# EAGLE design Processor (EAGLE 6.1)
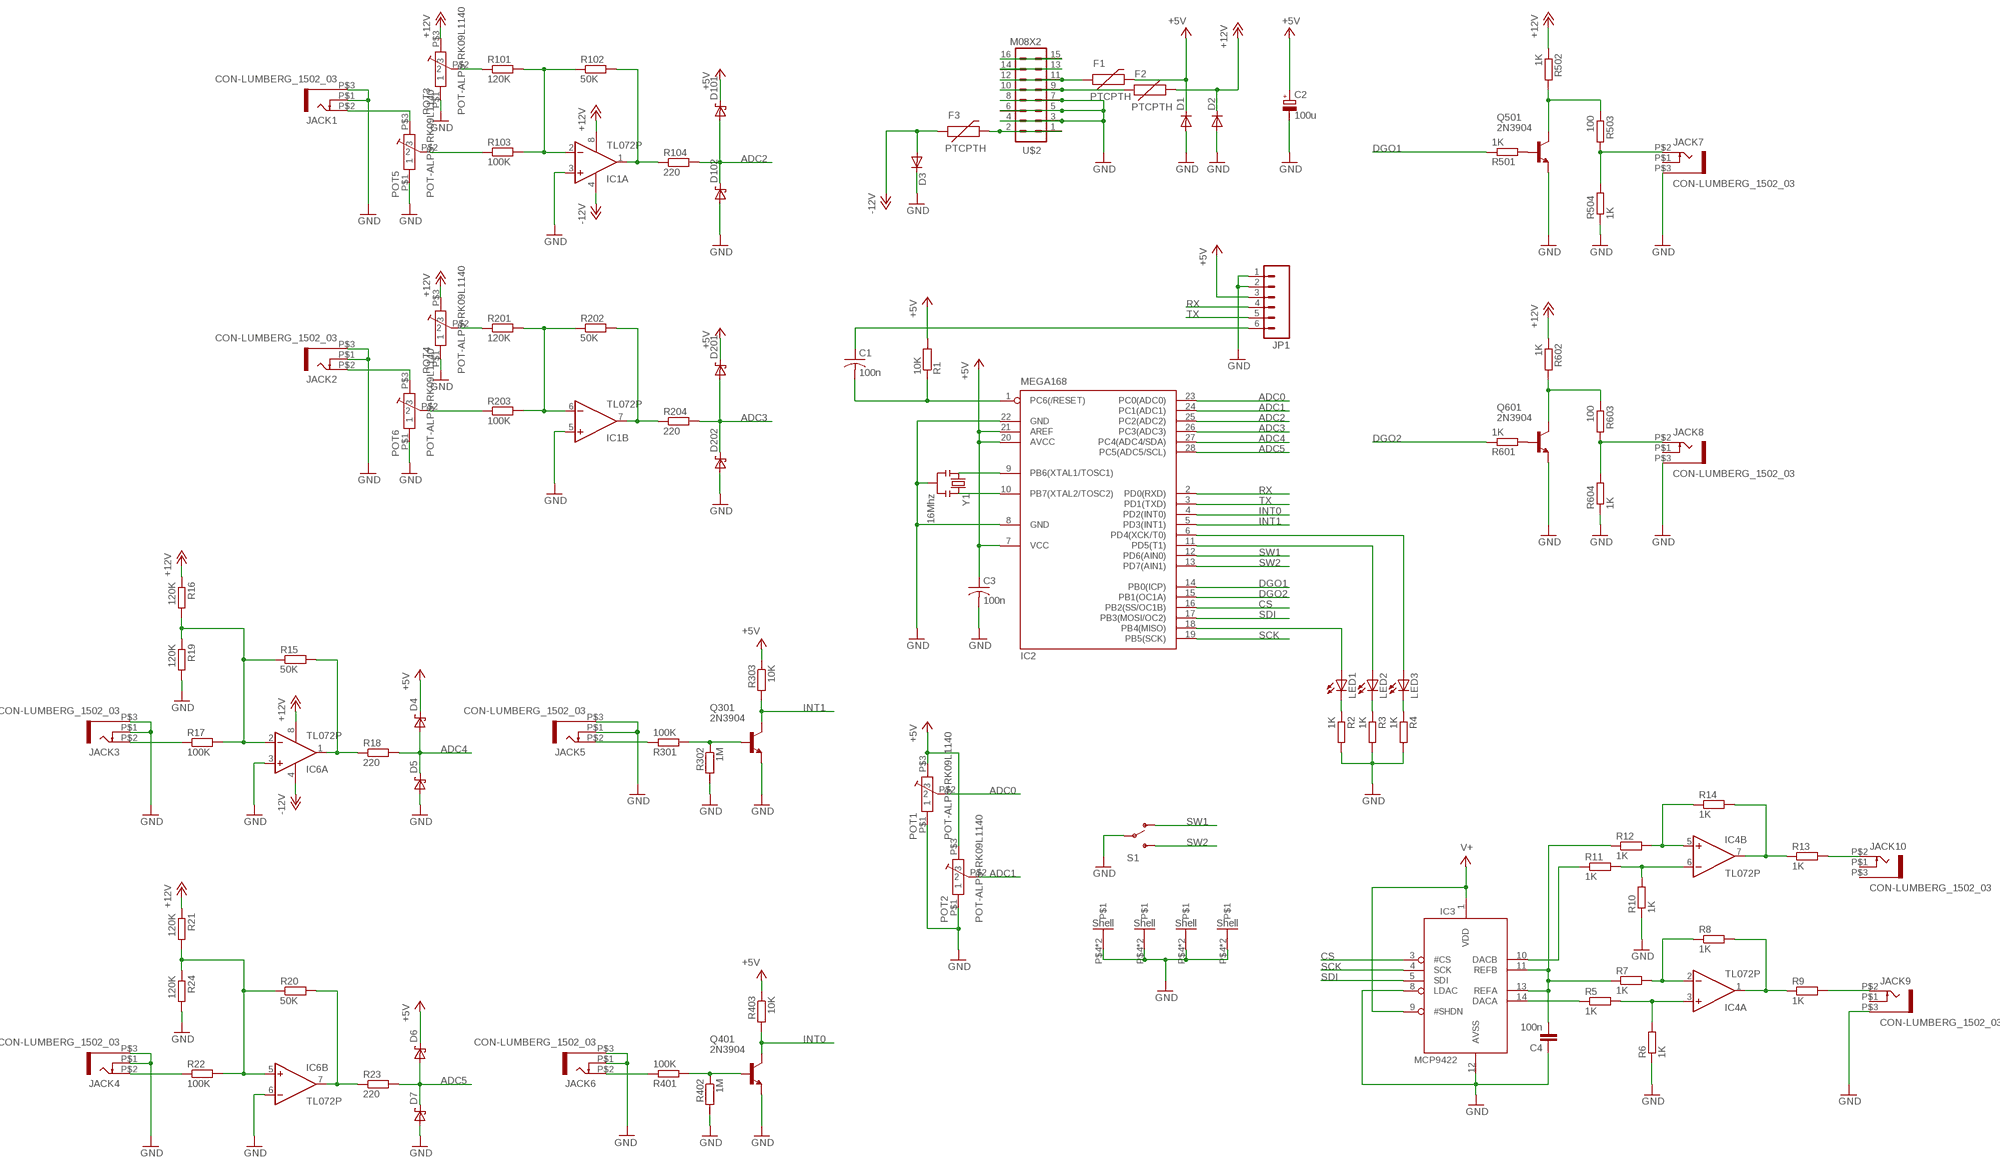
[diagram p0: schematic, sheet 1]

## Parts
C1  100n  C-US050-024X044  [C050-024X044]
C2  100u  CPOL-EUE5-6  [E5-6]
C3  100n  C-US050-024X044  [C050-024X044]
C4  100n  C-EU050-030X075  [C050-030X075]
D1  DIODEPTH  [DIODE-1N4001]
D2  DIODEPTH  [DIODE-1N4001]
D3  DIODEPTH  [DIODE-1N4001]
D4  DS_E2L  [E2LINE]
D5  DS_E2L  [E2LINE]
D6  DS_E2L  [E2LINE]
D7  DS_E2L  [E2LINE]
D101  DS_E2L  [E2LINE]
D102  DS_E2L  [E2LINE]
D201  DS_E2L  [E2LINE]
D202  DS_E2L  [E2LINE]
F1  PTCPTH  [PTC]
F2  PTCPTH  [PTC]
F3  PTCPTH  [PTC]
IC1  TL072P  [DIL08]
IC2  MEGA168  MEGA8-P  [DIL28-3]
IC3  MCP9422  [DIL14]
IC4  TL072P  [DIL08]
IC6  TL072P  [DIL08]
JACK1  CON-LUMBERG_1502_03  [CON-LUMBERG_1502_03]
JACK2  CON-LUMBERG_1502_03  [CON-LUMBERG_1502_03]
JACK3  CON-LUMBERG_1502_03  [CON-LUMBERG_1502_03]
JACK4  CON-LUMBERG_1502_03  [CON-LUMBERG_1502_03]
JACK5  CON-LUMBERG_1502_03  [CON-LUMBERG_1502_03]
JACK6  CON-LUMBERG_1502_03  [CON-LUMBERG_1502_03]
JACK7  CON-LUMBERG_1502_03  [CON-LUMBERG_1502_03]
JACK8  CON-LUMBERG_1502_03  [CON-LUMBERG_1502_03]
JACK9  CON-LUMBERG_1502_03  [CON-LUMBERG_1502_03]
JACK10  CON-LUMBERG_1502_03  [CON-LUMBERG_1502_03]
JP1  M06SIP  [1X06]
LED1  LED3MM  [LED3MM]
LED2  LED3MM  [LED3MM]
LED3  LED3MM  [LED3MM]
POT1  POT-ALPS-RK09L1140  [POT-ALPS-RK09L1140]
POT2  POT-ALPS-RK09L1140  [POT-ALPS-RK09L1140]
POT3  POT-ALPS-RK09L1140  [POT-ALPS-RK09L1140]
POT4  POT-ALPS-RK09L1140  [POT-ALPS-RK09L1140]
POT5  POT-ALPS-RK09L1140  [POT-ALPS-RK09L1140]
POT6  POT-ALPS-RK09L1140  [POT-ALPS-RK09L1140]
Q301  2N3904  [TO92]
Q401  2N3904  [TO92]
Q501  2N3904  [TO92]
Q601  2N3904  [TO92]
R1  10K  R-EU_0204/7  [0204/7]
R2  1K  R-EU_0204/7  [0204/7]
R3  1K  R-EU_0204/7  [0204/7]
R4  1K  R-EU_0204/7  [0204/7]
R5  1K  R-EU_0204/7  [0204/7]
R6  1K  R-EU_0204/7  [0204/7]
R7  1K  R-EU_0204/7  [0204/7]
R8  1K  R-EU_0204/7  [0204/7]
R9  1K  R-EU_0204/7  [0204/7]
R10  1K  R-EU_0204/7  [0204/7]
R11  1K  R-EU_0204/7  [0204/7]
R12  1K  R-EU_0204/7  [0204/7]
R13  1K  R-EU_0204/7  [0204/7]
R14  1K  R-EU_0204/7  [0204/7]
R15  50K  R-EU_0204/7  [0204/7]
R16  120K  R-EU_0204/7  [0204/7]
R17  100K  R-EU_0204/7  [0204/7]
R18  220  R-EU_0204/7  [0204/7]
R19  120K  R-EU_0204/7  [0204/7]
R20  50K  R-EU_0204/7  [0204/7]
R21  120K  R-EU_0204/7  [0204/7]
R22  100K  R-EU_0204/7  [0204/7]
R23  220  R-EU_0204/7  [0204/7]
R24  120K  R-EU_0204/7  [0204/7]
R101  120K  R-EU_0204/7  [0204/7]
R102  50K  R-EU_0204/7  [0204/7]
R103  100K  R-EU_0204/7  [0204/7]
R104  220  R-EU_0204/7  [0204/7]
R201  120K  R-EU_0204/7  [0204/7]
R202  50K  R-EU_0204/7  [0204/7]
R203  100K  R-EU_0204/7  [0204/7]
R204  220  R-EU_0204/7  [0204/7]
R301  100K  R-EU_0204/7  [0204/7]
R302  1M  R-EU_0204/7  [0204/7]
R303  10K  R-EU_0204/7  [0204/7]
R401  100K  R-EU_0204/7  [0204/7]
R402  1M  R-EU_0204/7  [0204/7]
R403  10K  R-EU_0204/7  [0204/7]
R501  1K  R-EU_0204/7  [0204/7]
R502  1K  R-EU_0204/7  [0204/7]
R503  100  R-EU_0204/7  [0204/7]
R504  1K  R-EU_0204/7  [0204/7]
R601  1K  R-EU_0204/7  [0204/7]
R602  1K  R-EU_0204/7  [0204/7]
R603  100  R-EU_0204/7  [0204/7]
R604  1K  R-EU_0204/7  [0204/7]
S1  SWITCH-SPST  [SWITCH-SPDT-SALECOM-T8014]
U$2  M08X2  [2X8]
Y1  16Mhz  RESONATORPTH  [RESONATOR-PTH]

## Nets
+5V: C2.+ C3.1 D1.C D4.1(K) D6.1(K) D101.1(K) D201.1(K) F1.P$2 IC2.7(VCC) IC2.20(AVCC) IC2.21(AREF) JP1.3 POT1.P$3 POT2.P$3 R1.2 R303.1 R403.1
+12V: D2.C F2.P$2 IC1.8(P:V+) IC6.8(P:V+) POT3.P$3 POT4.P$3 R16.1 R21.1 R502.1 R602.1
-12V: D3.A F3.P$1 IC1.4(P:V-) IC6.4(P:V-)
ADC0: IC2.23(PC0(ADC0)) POT1.P$2
ADC1: IC2.24(PC1(ADC1)) POT2.P$2
ADC2: D101.2(A) D102.1(K) IC2.25(PC2(ADC2)) R104.2
ADC3: D201.2(A) D202.1(K) IC2.26(PC3(ADC3)) R204.2
ADC4: D4.2(A) D5.1(K) IC2.27(PC4(ADC4/SDA)) R18.2
ADC5: D6.2(A) D7.1(K) IC2.28(PC5(ADC5/SCL)) R23.2
ALTA: IC2.11(PD5(T1)) LED2.A
CS: IC2.16(PB2(SS/OC1B)) IC3.3(#CS)
DGO1: IC2.14(PB0(ICP)) R501.1
DGO2: IC2.15(PB1(OC1A)) R601.1
GND: C2.- C3.2 C4.1 D1.A D2.A D3.C D5.2(A) D7.2(A) D102.2(A) D202.2(A) IC1.3(A:+IN) IC1.5(B:+IN) IC2.8(GND) IC2.22(GND) IC3.8(LDAC) IC3.12(AVSS) IC6.3(A:+IN) IC6.6(B:-IN) JACK1.P$1 JACK1.P$3 JACK2.P$1 JACK2.P$3 JACK3.P$1 JACK3.P$3 JACK4.P$1 JACK4.P$3 JACK5.P$1 JACK5.P$3 JACK6.P$1 JACK6.P$3 JACK7.P$3 JACK8.P$3 JACK9.P$3 JP1.1 JP1.2 POT1.P$1 POT2.P$1 POT3.P$1 POT3.P$4 POT3.P$6 POT4.P$1 POT4.P$4 POT4.P$6 POT5.P$1 POT5.P$4 POT5.P$6 POT6.P$1 POT6.P$4 POT6.P$6 Q301.3(E) Q401.3(E) Q501.3(E) Q601.3(E) R2.2 R3.2 R4.2 R6.1 R10.1 R19.2 R24.2 R302.2 R402.2 R504.1 R604.1 S1.2(P) U$2.3 U$2.4 U$2.5 U$2.6 U$2.7 U$2.8 Y1.2
INT0: IC2.4(PD2(INT0)) Q401.1(C) R403.2
INT1: IC2.5(PD3(INT1)) Q301.1(C) R303.2
N$1: JACK1.P$2 POT5.P$3
N$2: IC1.2(A:-IN) R101.2 R102.1 R103.2
N$3: POT3.P$2 R101.1
N$4: IC1.1(A:OUT) R102.2 R104.1
N$5: POT5.P$2 R103.1
N$6: F3.P$2 U$2.1 U$2.2
N$7: IC1.6(B:-IN) R201.2 R202.1 R203.2
N$8: POT4.P$2 R201.1
N$9: IC1.7(B:OUT) R202.2 R204.1
N$10: POT6.P$2 R203.1
N$11: C4.2 IC3.11(REFB) IC3.13(REFA) R7.1 R12.1
N$12: JACK2.P$2 POT6.P$3
N$13: IC4.2(A:-IN) R7.2 R8.1
N$14: IC4.3(A:+IN) R5.2 R6.2
N$15: IC3.14(DACA) R5.1
N$16: IC4.1(A:OUT) R8.2 R9.1
N$17: JACK9.P$2 R9.2
N$19: IC2.18(PB4(MISO)) LED1.A
N$20: IC2.9(PB6(XTAL1/TOSC1)) Y1.1
N$21: IC2.10(PB7(XTAL2/TOSC2)) Y1.3
N$22: IC6.2(A:-IN) R15.1 R16.2 R17.2 R19.1
N$23: LED1.K(C) R2.1
N$24: LED2.K(C) R3.1
N$25: LED3.K(C) R4.1
N$26: Q601.2(B) R601.2
N$27: Q301.2(B) R301.2 R302.1
N$28: JACK5.P$2 R301.1
N$29: C1.1 JP1.6
N$30: JACK8.P$2 R603.2 R604.2
N$31: Q401.2(B) R401.2 R402.1
N$32: Q601.1(C) R602.2 R603.1
N$33: Q501.2(B) R501.2
N$34: IC3.10(DACB) R11.1
N$35: IC4.6(B:-IN) R10.2 R11.2
N$36: JACK7.P$2 R503.2 R504.2
N$37: Q501.1(C) R502.2 R503.1
N$38: IC4.5(B:+IN) R12.2 R14.1
N$39: C1.2 IC2.1(PC6(/RESET)) R1.1
N$40: JACK6.P$2 R401.1
N$41: IC4.7(B:OUT) R13.1 R14.2
N$42: JACK10.P$2 R13.2
N$43: U$2.13 U$2.14
N$44: F1.P$1 U$2.11 U$2.12
N$45: F2.P$1 U$2.9 U$2.10
N$46: IC6.1(A:OUT) R15.2 R18.1
N$47: JACK3.P$2 R17.1
N$48: IC6.7(B:OUT) R20.2 R23.1
N$49: JACK4.P$2 R22.1
N$50: IC6.5(B:+IN) R20.1 R21.2 R22.2 R24.1
PWR_BUS: U$2.15 U$2.16
RX: IC2.2(PD0(RXD)) JP1.4
SCK: IC2.19(PB5(SCK)) IC3.4(SCK)
SDI: IC2.17(PB3(MOSI/OC2)) IC3.5(SDI)
SW1: IC2.12(PD6(AIN0)) S1.1(O)
SW2: IC2.13(PD7(AIN1)) S1.3(S)
TRIGA: IC2.6(PD4(XCK/T0)) LED3.A
TX: IC2.3(PD1(TXD)) JP1.5
V+: IC3.1(VDD) IC3.9(#SHDN)
Unconnected: JACK7.P$1 JACK8.P$1 JACK9.P$1 JACK10.P$1 JACK10.P$3 POT1.P$4 POT1.P$6 POT2.P$4 POT2.P$6

## Power pins joined to a net without a drawn wire
V+: IC4.8(P:V+)
V-: IC4.4(P:V-)

## Library data of the parts
C1 C3 = rcl:C-US: CAPACITOR, American symbol
C2 = rcl:CPOL-EU: POLARIZED CAPACITOR, European symbol
C4 = resistor:C-EU: CAPACITOR, European symbol
D1-D3 = SparkFun:DIODE: Diode These are standard reverse protection diodes and small signal diodes. SMA package can handle up to about 1A. SOD-323 can handle about 200mA. What the SOD-323 package when ordering, there are some mfgs out there that are 5-pin packages.
D4-D7 D101 D102 D201 D202 = zetex:DS_E2L: SHOTTKY DIODE; OC_FARNELL: unknown; OC_NEWARK: unknown
F1-F3 = SparkFun:PTC: Resettable Fuse PTC Resettable Fuse. Spark Fun Electronics SKU : COM-08357
IC1 IC4 IC6 = linear:TL072: OP AMP
IC2 = atmel:MEGA8-P: MICROCONTROLLER 8 Kbytes FLASH, 1 kbytes SRAM, 512 bytes EEPROM, USART, 4-channel 10 bit ADC, 2-channel 8 bit ADC Pin compatible with Atmega48, ATMega88, ATMega168 Source: avr.lbr; OC_FARNELL: unknown; OC_NEWARK: unknown
IC3 = adafruit:MCP9422
JACK1-JACK10 = Rebel:CON-LUMBERG_1502_03
JP1 = SparkFun:M06: Header 6 Standard 6-pin 0.1" header. Use with straight break away headers (SKU : PRT-00116), right angle break away headers (PRT-00553), swiss pins (PRT-00743), machine pins (PRT-00117), and female headers (PRT-00115). Molex polarized connector foot print use with SKU : PRT-08094 with associated crimp pins and housings. NOTES ON THE VARIANTS LOCK and LOCK_LONGPADS... This footprint was designed to help hold the alignment of a through-hole component (i.e. 6-pin header) while soldering it into place. You may notice that each hole has been shifted either up or down by 0.005 of an inch from it's more standard position (which is a perfectly straight line). This slight alteration caused the pins (the squares in the middle) to touch the edges of the holes. Because they are alternating, it causes a "brace" to hold the component in place. 0.005 has proven to be the perfect amount of "off-center" position when using our standard breakaway headers. Although looks a little odd when you look at the bare footprint, once you have a header in there, the alteration is very hard to notice. Also, if you push a header all the way into place, it is covered up entirely on the bottom side. This idea of altering the position of holes to aid alignment will be further integrated into the Sparkfun Library for other footprints. It can help hold any component with 3 or more connection pins.
LED1-LED3 = led:LED: LED OSRAM: - CHIPLED LG R971, LG N971, LY N971, LG Q971, LY Q971, LO R971, LY R971 LH N974, LH R974 LS Q976, LO Q976, LY Q976 LO Q996 - Hyper CHIPLED LW Q18S LB Q993, LB Q99A, LB R99A - SideLED LS A670, LO A670, LY A670, LG A670, LP A670 LB A673, LV A673, LT A673, LW A673 LH A674 LY A675 LS A676, LA A676, LO A676, LY A676, LW A676 LS A679, LY A679, LG A679 - Hyper Micro SIDELED® LS Y876, LA Y876, LO Y876, LY Y876 LT Y87S - SmartLED LW L88C, LW L88S LB L89C, LB L89S, LG L890 LS L89K, LO L89K, LY L89K LS L896, LA L896, LO L896, LY L896 - TOPLED LS T670, LO T670, LY T670, LG T670, LP T670 LSG T670, LSP T670, LSY T670, LOP T670, LYG T670 LG T671, LOG T671, LSG T671 LB T673, LV T673, LT T673, LW T673 LH T674 LS T676, LA T676, LO T676, LY T676, LB T676, LH T676, LSB T676, LW T676 LB T67C, LV T67C, LT T67C, LS T67K, LO T67K, LY T67K, LW E67C LS E67B, LA E67B, LO E67B, LY E67B, LB E67C, LV E67C, LT E67C LW T67C LS T679, LY T679, LG T679 LS T770, LO T770, LY T770, LG T770, LP T770 LB T773, LV T773, LT T773, LW T773 LH T774 LS E675, LA E675, LY E675, LS T675 LS T776, LA T776, LO T776, LY T776, LB T776 LHGB T686 LT T68C, LB T68C - Hyper Mini TOPLED® LB M676 - Mini TOPLED Santana® LG M470 LS M47K, LO M47K, LY M47K Source: http://www.osram.convergy.de LUXEON: - LUMILED® LXK2-PW12-R00, LXK2-PW12-S00, LXK2-PW14-U00, LXK2-PW14-V00 LXK2-PM12-R00, LXK2-PM12-S00, LXK2-PM14-U00 LXK2-PE12-Q00, LXK2-PE12-R00, LXK2-PE12-S00, LXK2-PE14-T00, LXK2-PE14-U00 LXK2-PB12-K00, LXK2-PB12-L00, LXK2-PB12-M00, LXK2-PB14-N00, LXK2-PB14-P00, LXK2-PB14-Q00 LXK2-PR12-L00, LXK2-PR12-M00, LXK2-PR14-Q00, LXK2-PR14-R00 LXK2-PD12-Q00, LXK2-PD12-R00, LXK2-PD12-S00 LXK2-PH12-R00, LXK2-PH12-S00 LXK2-PL12-P00, LXK2-PL12-Q00, LXK2-PL12-R00 Source: www.luxeon.com KINGBRIGHT: KA-3528ASYC Source: www.kingbright.com
POT1-POT6 = Rebel:POT-ALPS-RK09L
Q301 Q401 Q501 Q601 = transistor-npn:2N3904: NPN Transistor
R1-R14 R301-R303 R401-R403 R501-R504 R601-R604 = rcl:R-EU_: RESISTOR, European symbol
R15-R24 R101-R104 R201-R204 = resistor:R-EU_: RESISTOR, European symbol
S1 = Rebel:SWITCH-SPST: SPST Switch Simple slide switch. Spark Fun Electronics SKU : COM-00102
U$2 = SparkFun:M08X2
Y1 = SparkFun:RESONATOR: Resonator Small SMD resonator. This is the itty bitty 10/20MHz resonators with built in caps. CSTCE10M0G55 and CSTCE20M0V53. Footprint has been reviewed closely but hasn't been tested yet.

## Board
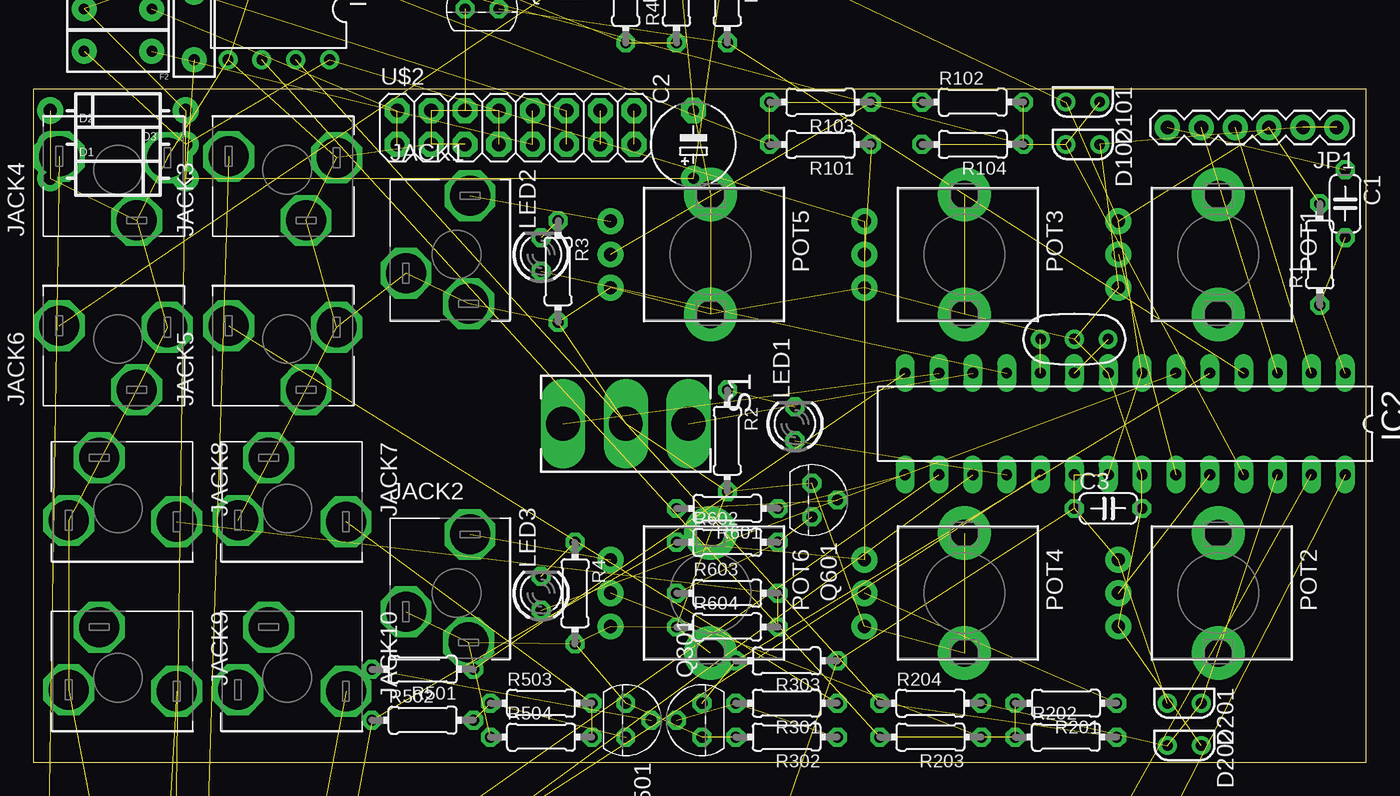
[diagram p1: board, top side]
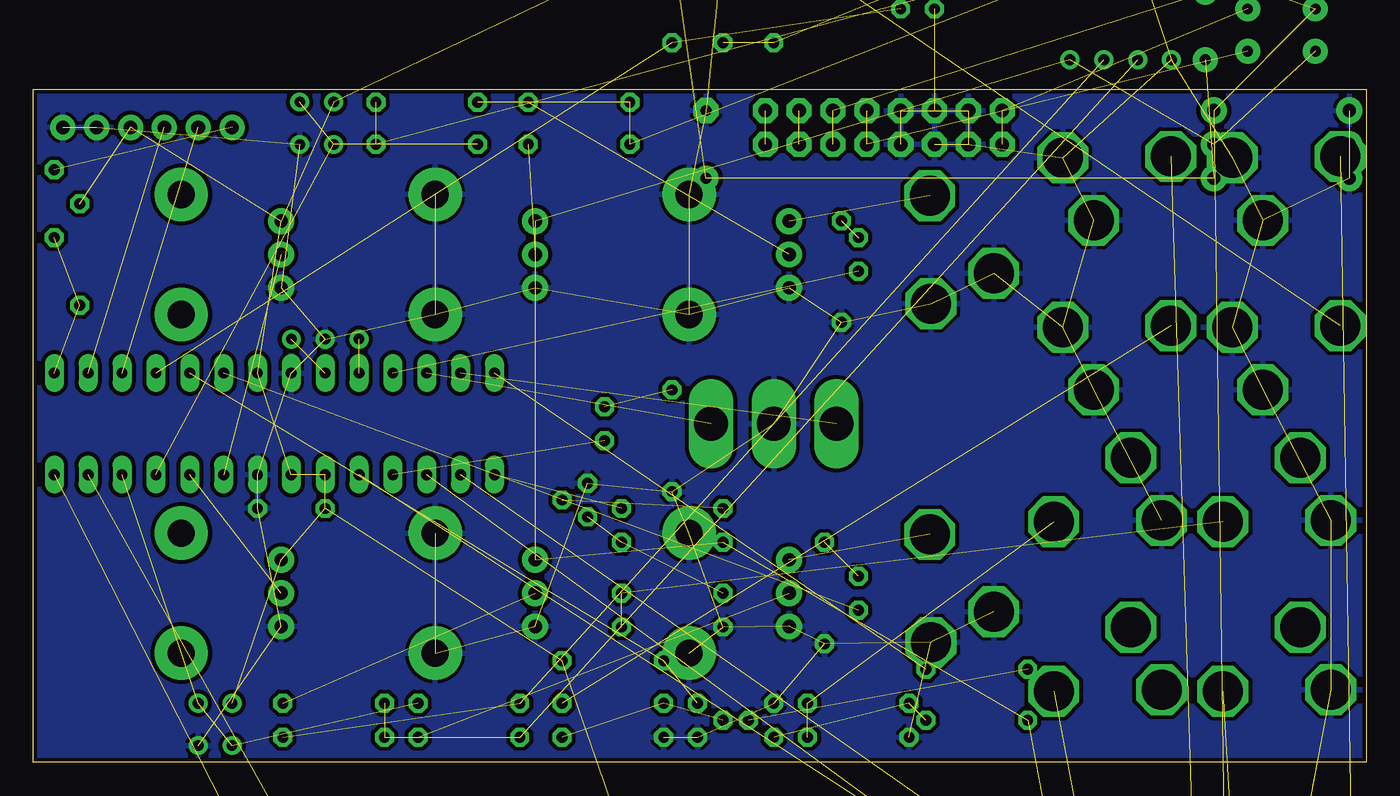
[diagram p2: board, bottom side, seen from below]

Size 100 x 50.5 mm. Coordinates in mm from the lower left corner, seen from the top.
Outline: 0,0 100,0 100,50.5 0,50.5 0,0
Copper layers (1*16): Top 0.035mm / dielectric 1.5mm / Bottom 0.035mm
Design rules: minimum track width 6mil, minimum drill 12mil, track to track 8mil, track to pad 8mil, pad to pad 8mil, via to via 8mil, smd to smd 0mil, copper to edge 10mil, drill to drill 10mil, minimum pad ring 12mil, minimum via ring 6mil, stop-mask expansion 2mil, vias tented up to drill 100mil, thermal gap 10mil

### Footprints (pad centres in the part's own frame; a part is rotated, then mirrored left to right if it is on the bottom)
C050-024X044 = drill 0.813 octagon: 1 -2.54,0; 2 2.54,0
E5-6 = drill 0.813 pad 1.905: + -2.54,0 | drill 0.813 pad 1.905 octagon: - 2.54,0
C050-030X075 = drill 0.813 octagon: 1 -2.54,0; 2 2.54,0
DIODE-1N4001 = drill 1 pad 1.981: A -5.08,0; C 5.08,0
E2LINE = drill 0.8 pad 1.397: 1 0,-1.27; 2 0,1.27
PTC = drill 0.8 pad 1.88: P$1 -2.54,0; P$2 2.54,0
DIL08 = drill 0.813 pad 1.27: 1 -3.81,-3.81; 2 -1.27,-3.81; 3 1.27,-3.81; 4 3.81,-3.81; 5 3.81,3.81; 6 1.27,3.81; 7 -1.27,3.81; 8 -3.81,3.81
DIL28-3 = drill 0.813 long: 1 -16.51,-3.81; 2 -13.97,-3.81; 3 -11.43,-3.81; 4 -8.89,-3.81; 5 -6.35,-3.81; 6 -3.81,-3.81; 7 -1.27,-3.81; 8 1.27,-3.81; 9 3.81,-3.81; 10 6.35,-3.81; 11 8.89,-3.81; 12 11.43,-3.81; 13 13.97,-3.81; 14 16.51,-3.81; 15 16.51,3.81; 16 13.97,3.81; 17 11.43,3.81; 18 8.89,3.81; 19 6.35,3.81; 20 3.81,3.81; 21 1.27,3.81; 22 -1.27,3.81; 23 -3.81,3.81; 24 -6.35,3.81; 25 -8.89,3.81; 26 -11.43,3.81; 27 -13.97,3.81; 28 -16.51,3.81
DIL14 = drill 0.813 long: 1 -7.62,-3.81; 2 -5.08,-3.81; 3 -2.54,-3.81; 4 0,-3.81; 5 2.54,-3.81; 6 5.08,-3.81; 7 7.62,-3.81; 8 7.62,3.81; 9 5.08,3.81; 10 2.54,3.81; 11 0,3.81; 12 -2.54,3.81; 13 -5.08,3.81; 14 -7.62,3.81
CON-LUMBERG_1502_03 = drill 3 pad 3 octagon: P$1 -3.8,-1.4; P$2 1,4.4; P$3 0.9,-3.7
1X06 = drill 1.016 pad 1.88: 1 0,0; 2 2.54,0; 3 5.08,0; 4 7.62,0; 5 10.16,0; 6 12.7,0
LED3MM = drill 0.813 octagon: A -1.27,0; K 1.27,0
POT-ALPS-RK09L1140 = drill 1 pad 1.93: P$1 2.5,-7.5; P$2 0,-7.5; P$3 -2.5,-7.5 | drill 2.032 pad 4: P$4 -4.5,0; P$6 4.5,0
TO92 = drill 0.813 octagon: 1 1.27,0; 2 0,1.905; 3 -1.27,0
0204/7 = drill 0.813 octagon: 1 -3.81,0; 2 3.81,0
SWITCH-SPDT-SALECOM-T8014 = drill 2.54 pad 2.54 long: 1 0,4.699; 2 0,0; 3 0,-4.699
2X8 = drill 1.016 pad 1.88 octagon: 1 0,0; 2 0,2.54; 3 2.54,0; 4 2.54,2.54; 5 5.08,0; 6 5.08,2.54; 7 7.62,0; 8 7.62,2.54; 9 10.16,0; 10 10.16,2.54; 11 12.7,0; 12 12.7,2.54; 13 15.24,0; 14 15.24,2.54; 15 17.78,0; 16 17.78,2.54
RESONATOR-PTH = drill 0.8: 1 -2.54,0; 2 0,0; 3 2.54,0

### Placement (x,y rotation side)
C1  98.42,41.91 270 top
C2  49.53,46.35 90 top
C3  80.64,19.05 0 top
C4  2.54,-27.94 0 top  (outside the outline)
D1  6.35,43.81 0 top
D2  6.35,46.35 0 top
D3  6.35,48.9 180 top
D4  12.7,-128.27 0 top  (outside the outline)
D5  16.51,-128.27 0 top  (outside the outline)
D6  12.7,-147.32 0 top  (outside the outline)
D7  16.51,-147.32 0 top  (outside the outline)
D101  78.74,49.53 270 top
D102  78.74,46.35 270 top
D201  86.36,4.45 270 top
D202  86.36,1.27 270 top
F1  12.06,55.24 270 top
F2  6.35,53.34 180 top
F3  6.35,56.52 0 top  (outside the outline)
IC1  18.41,56.52 180 top
IC2  81.92,25.4 180 top
IC3  8.89,-17.78 0 top  (outside the outline)
IC4  5.08,-36.83 0 top  (outside the outline)
IC6  5.08,-129.54 0 top  (outside the outline)
JACK1  31.75,38.1 0 top
JACK2  31.75,12.7 0 top
JACK3  19.05,44.45 90 top
JACK4  6.35,44.45 90 top
JACK5  19.05,31.75 90 top
JACK6  6.35,31.75 90 top
JACK7  19.05,19.05 270 top
JACK8  6.35,19.05 270 top
JACK9  6.35,6.35 270 top
JACK10  19.05,6.35 270 top
JP1  97.79,47.62 180 top
LED1  57.15,25.4 90 top
LED2  38.1,38.1 90 top
LED3  38.1,12.7 90 top
POT1  88.9,38.1 270 top
POT2  88.9,12.7 270 top
POT3  69.85,38.1 270 top
POT4  69.85,12.7 270 top
POT5  50.8,38.1 270 top
POT6  50.8,12.7 270 top
Q301  50.16,3.17 90 top
Q401  33.66,56.52 0 top  (outside the outline)
Q501  44.45,3.17 270 top
Q601  58.42,19.68 270 top
R1  96.52,38.1 90 top
R2  52.07,24.13 270 top
R3  39.37,36.83 270 top
R4  40.64,12.7 270 top
R5  2.54,-54.61 0 top  (outside the outline)
R6  2.54,-58.42 0 top  (outside the outline)
R7  2.54,-62.23 0 top  (outside the outline)
R8  2.54,-66.04 0 top  (outside the outline)
R9  2.54,-69.85 0 top  (outside the outline)
R10  2.54,-73.66 0 top  (outside the outline)
R11  2.54,-77.47 0 top  (outside the outline)
R12  2.54,-81.28 0 top  (outside the outline)
R13  2.54,-85.09 0 top  (outside the outline)
R14  2.54,-88.9 0 top  (outside the outline)
R15  24.13,-127 0 top  (outside the outline)
R16  2.54,-137.16 0 top  (outside the outline)
R17  12.7,-137.16 0 top  (outside the outline)
R18  22.86,-137.16 0 top  (outside the outline)
R19  2.54,-140.97 0 top  (outside the outline)
R20  2.54,-154.94 0 top  (outside the outline)
R21  12.7,-154.94 0 top  (outside the outline)
R22  2.54,-158.75 0 top  (outside the outline)
R23  12.7,-158.75 0 top  (outside the outline)
R24  2.54,-162.56 0 top  (outside the outline)
R101  59.05,46.35 180 top
R102  70.48,49.53 0 top
R103  59.05,49.53 180 top
R104  70.48,46.35 180 top
R201  77.47,4.45 180 top
R202  77.47,1.91 0 top
R203  67.31,1.91 180 top
R204  67.31,4.45 0 top
R301  56.52,4.45 180 top
R302  56.52,1.91 180 top
R303  56.52,7.62 180 top
R401  44.45,57.78 270 top  (outside the outline)
R402  48.26,57.78 90 top  (outside the outline)
R403  52.07,57.78 270 top  (outside the outline)
R501  29.21,6.99 180 top
R502  29.21,3.17 0 top
R503  38.1,4.45 0 top
R504  38.1,1.91 0 top
R601  52.07,19.05 180 top
R602  52.07,16.51 0 top
R603  52.07,12.7 0 top
R604  52.07,10.16 0 top
S1  44.45,25.4 270 top
U$2  27.3,46.35 0 top
Y1  78.11,31.75 180 top

### Tracks (layer width: path | path; a pad name or v marks a point on that pad's centre or on a via)
+5V  (16 unrouted)
+12V  (9 unrouted)
-12V  (3 unrouted)
ADC0  (1 unrouted)
ADC1  (1 unrouted)
ADC2  (3 unrouted)
ADC3  (3 unrouted)
ADC4  (3 unrouted)
ADC5  (3 unrouted)
ALTA  (1 unrouted)
CS  (1 unrouted)
DGO1  (1 unrouted)
DGO2  (1 unrouted)
GND  (71 unrouted)
  pour Bottom (isolate 0.305): 0,0 0,50.8 100.33,50.8 100.33,0
INT0  (2 unrouted)
INT1  (2 unrouted)
N$1  (1 unrouted)
N$2  (3 unrouted)
N$3  (1 unrouted)
N$4  (2 unrouted)
N$5  (1 unrouted)
N$6  (2 unrouted)
N$7  (3 unrouted)
N$8  (1 unrouted)
N$9  (2 unrouted)
N$10  (1 unrouted)
N$11  (4 unrouted)
N$12  (1 unrouted)
N$13  (2 unrouted)
N$14  (2 unrouted)
N$15  (1 unrouted)
N$16  (2 unrouted)
N$17  (1 unrouted)
N$19  (1 unrouted)
N$20  (1 unrouted)
N$21  (1 unrouted)
N$22  (4 unrouted)
N$23  (1 unrouted)
N$24  (1 unrouted)
N$25  (1 unrouted)
N$26  (1 unrouted)
N$27  (2 unrouted)
N$28  (1 unrouted)
N$29  (1 unrouted)
N$30  (2 unrouted)
N$31  (2 unrouted)
N$32  (2 unrouted)
N$33  (1 unrouted)
N$34  (1 unrouted)
N$35  (2 unrouted)
N$36  (2 unrouted)
N$37  (2 unrouted)
N$38  (2 unrouted)
N$39  (2 unrouted)
N$40  (1 unrouted)
N$41  (2 unrouted)
N$42  (1 unrouted)
N$43  (1 unrouted)
N$44  (2 unrouted)
N$45  (2 unrouted)
N$46  (2 unrouted)
N$47  (1 unrouted)
N$48  (2 unrouted)
N$49  (1 unrouted)
N$50  (4 unrouted)
PWR_BUS  (1 unrouted)
RX  (1 unrouted)
SCK  (1 unrouted)
SDI  (1 unrouted)
SW1  (1 unrouted)
SW2  (1 unrouted)
TRIGA  (1 unrouted)
TX  (1 unrouted)
V+  (2 unrouted)